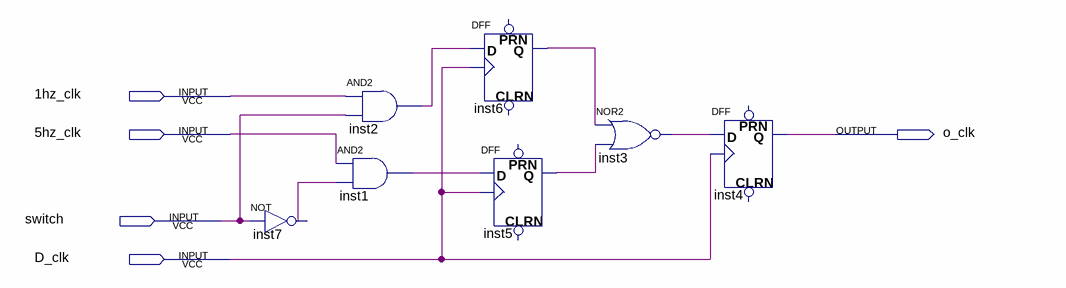
[diagram p0: schematic sheet]
// Quartus schematic diff_clk.bdf as structural Verilog: 7 symbols, 5 pins
module diff_clk (
  input  \1hz_clk ,
  input  \5hz_clk ,
  input  switch,
  input  D_clk,
  output o_clk
);

  wire inst1_out, inst2_out, inst3_out, inst5_q, inst6_q, inst7_out;

  not inst7 (inst7_out, switch);
  and inst2 (inst2_out, \1hz_clk , switch);
  and inst1 (inst1_out, \5hz_clk , inst7_out);
  DFF inst6 (.CLK(D_clk), .D(inst2_out), .Q(inst6_q));  // open: CLRN, PRN
  DFF inst5 (.CLK(D_clk), .D(inst1_out), .Q(inst5_q));  // open: CLRN, PRN
  nor inst3 (inst3_out, inst6_q, inst5_q);
  DFF inst4 (.CLK(D_clk), .D(inst3_out), .Q(o_clk));  // open: CLRN, PRN
endmodule
